# Altium schematic sheet LCD_TouchBackLight.SchDoc: =ProjectTitle
size B; Engineer: H. Collector; Organization: IMR Engineering; Address1: 3621 Gin Way; Address2: Snellville, GA 30039; Address3: USA; SheetNumber: 5; SheetTotal: 10
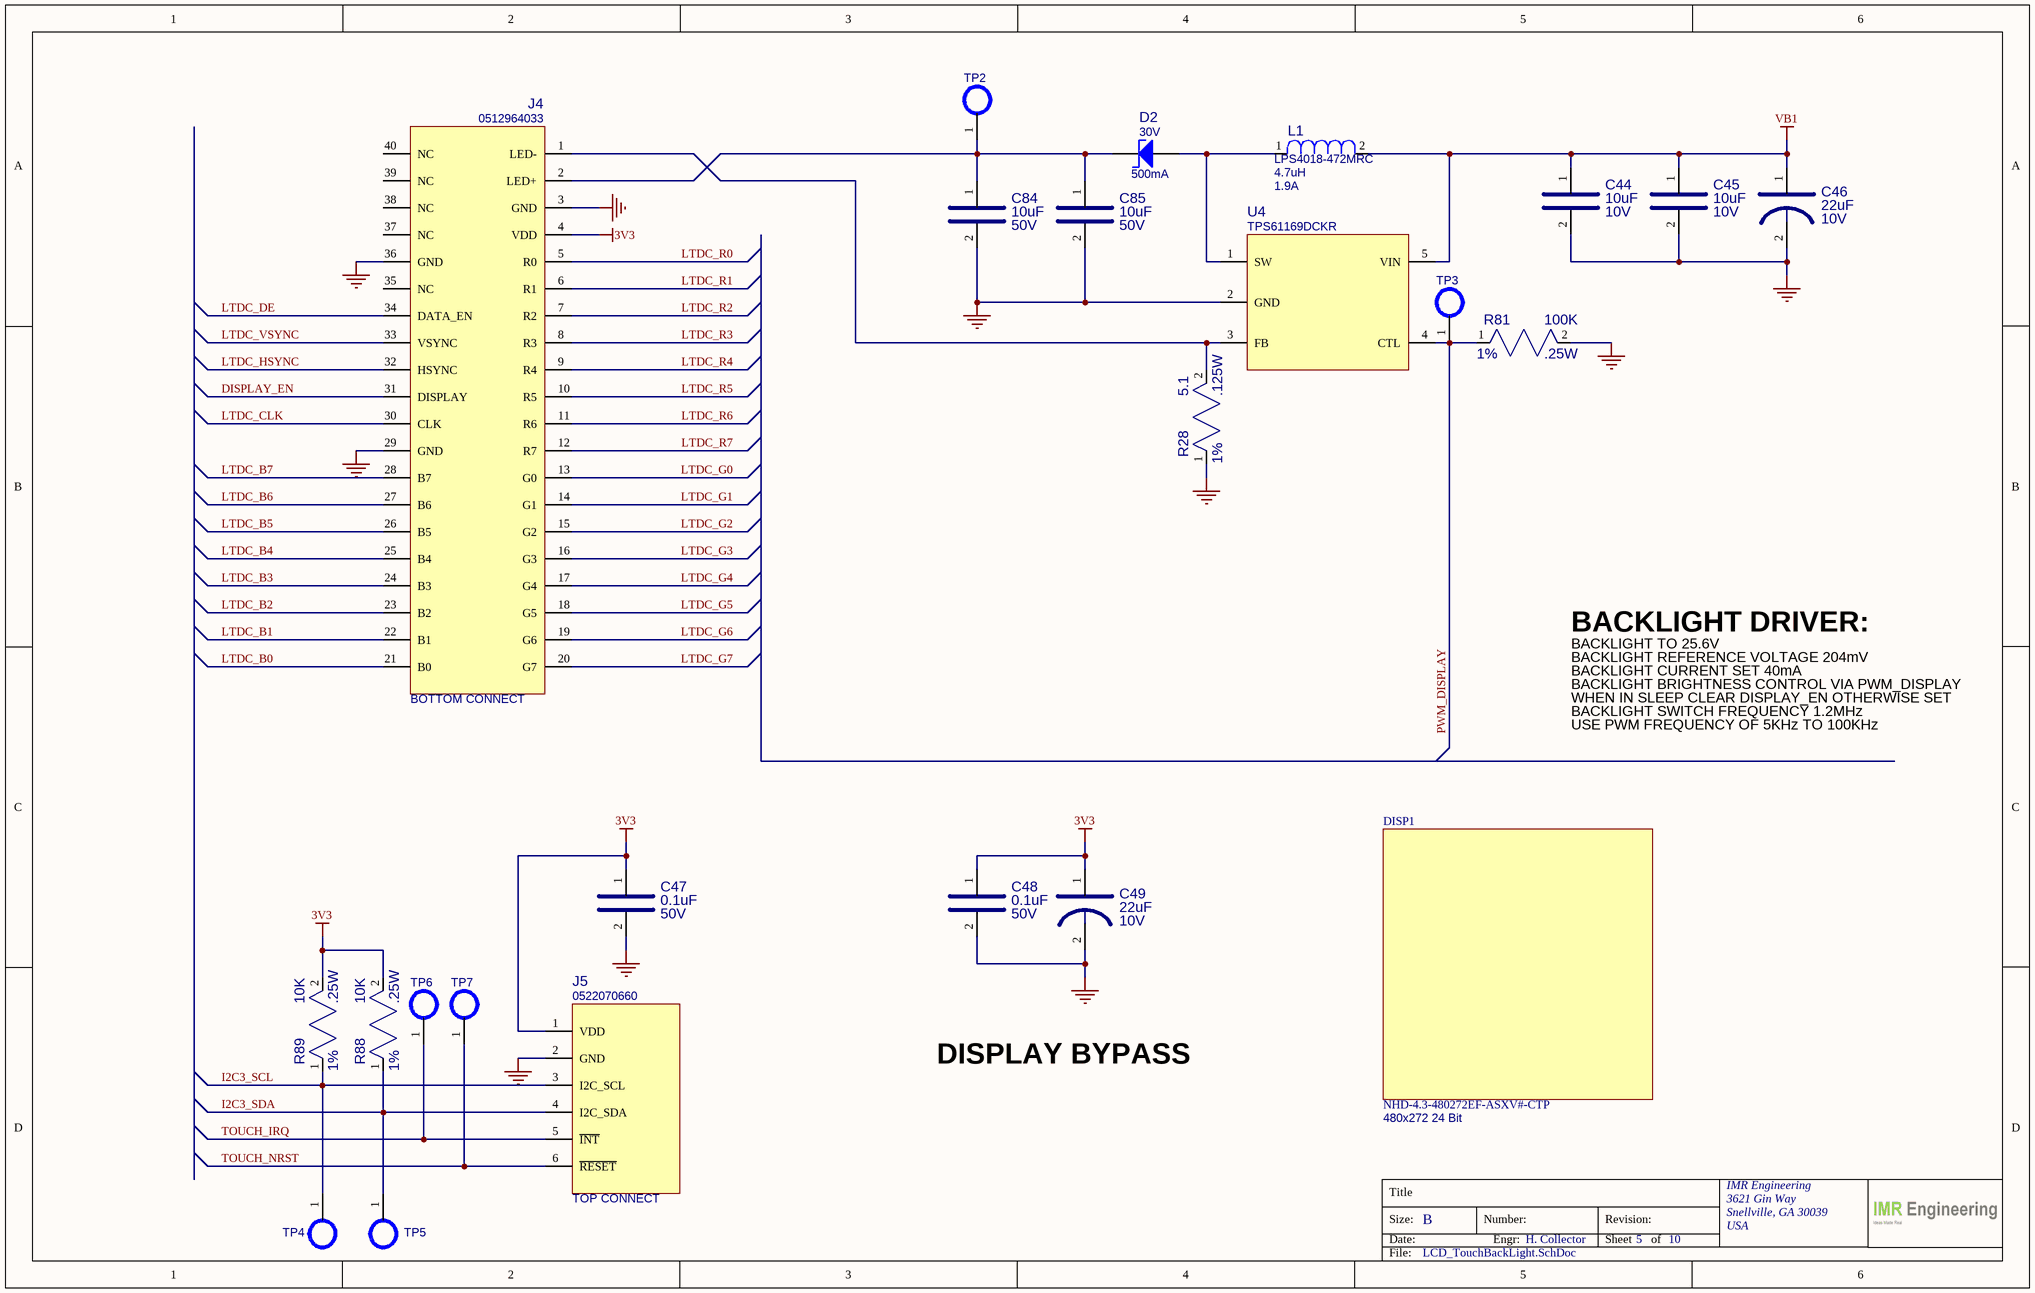
[diagram p0: LCD_TouchBackLight.SchDoc]

## Parts
C44  value 10uF  VOLTAGE: 10V  [CAP_0805]  (hidden comment: C2012X7R1A106K125AC)
C45  value 10uF  VOLTAGE: 10V  [CAP_0805]  (hidden comment: C2012X7R1A106K125AC)
C46  value 22uF  VOLTAGE: 10V  [CAP_1206_TANT]  (hidden comment: TAJA226M010RNJ)
C47  value 0.1uF  VOLTAGE: 50V  [CAP_0805]  (hidden comment: 08055C104KAT2A)
C48  value 0.1uF  VOLTAGE: 50V  [CAP_0805]  (hidden comment: 08055C104KAT2A)
C49  value 22uF  VOLTAGE: 10V  [CAP_1206_TANT]  (hidden comment: TAJA226M010RNJ)
C84  value 10uF  VOLTAGE: 50V  [CAP_1206]  (hidden comment: CL31A106KBHNNNE)
C85  value 10uF  VOLTAGE: 50V  [CAP_1206]  (hidden comment: CL31A106KBHNNNE)
D2  value 30V  Current: 500mA  [SOD123]  (hidden comment: PMEG3005EGWJ)
DISP1  NHD-4.3-480272EF-ASXV#-CTP  value 480x272 24 Bit  [NHD_NHD-4.3-480272EF-ASXV#-CTP]
J4  0512964033  value BOTTOM CONNECT  [CONN_MOLEX_0512964033]
J5  0522070660  value TOP CONNECT  [CONN_MOLEX_0522070660]
L1  value 4.7uH  Current: 1.9A  [LPS4018]  (hidden comment: LPS4018-472MRC)
R28  value 5.1  TOLERANCE: 1%  POWER: .125W  [PMG_RES_0805]  (hidden comment: RC0805FR-075R1L)
R81  value 100K  TOLERANCE: 1%  POWER: .25W  [PMG_RES_0805]  (hidden comment: RK73H2ATTD1003F)
R88  value 10K  TOLERANCE: 1%  POWER: .25W  [RES_0805]  (hidden comment: SG73S2ATTD1002F)
R89  value 10K  TOLERANCE: 1%  POWER: .25W  [RES_0805]  (hidden comment: SG73S2ATTD1002F)
TP2  TP_0635MM_HOLE  [TP_0635MM_HOLE]  (value not drawn)  (no BOM)
TP3  TP_0635MM_HOLE  [TP_0635MM_HOLE]  (value not drawn)  (no BOM)
TP4  TP_0635MM_HOLE  [TP_0635MM_HOLE]  (value not drawn)  (no BOM)
TP5  TP_0635MM_HOLE  [TP_0635MM_HOLE]  (value not drawn)  (no BOM)
TP6  TP_0635MM_HOLE  [TP_0635MM_HOLE]  (value not drawn)  (no BOM)
TP7  TP_0635MM_HOLE  [TP_0635MM_HOLE]  (value not drawn)  (no BOM)
U4  TPS61169DCKR  [SC70-5_SOT-353_5-TSSOP]

## Nets
3V3: C47.1 C48.1 C49.1 J4.4(VDD) J5.1(VDD) R88.2 R89.2
GND: C44.2 C45.2 C46.2 C47.2 C48.2 C49.2 C84.2 C85.2 J4.3(GND) J4.29(GND) J4.36(GND) J5.2(GND) R28.1 R81.2 U4.2(GND)
VB1: C44.1 C45.1 C46.1 L1.2 U4.5(VIN)
DISPLAY_EN: J4.31(DISPLAY)
I2C3_SCL: J5.3(I2C_SCL) R89.1 TP4.1
I2C3_SDA: J5.4(I2C_SDA) R88.1 TP5.1
LTDC_B0: J4.21(B0)
LTDC_B1: J4.22(B1)
LTDC_B2: J4.23(B2)
LTDC_B3: J4.24(B3)
LTDC_B4: J4.25(B4)
LTDC_B5: J4.26(B5)
LTDC_B6: J4.27(B6)
LTDC_B7: J4.28(B7)
LTDC_CLK: J4.30(CLK)
LTDC_DE: J4.34(DATA_EN)
LTDC_G0: J4.13(G0)
LTDC_G1: J4.14(G1)
LTDC_G2: J4.15(G2)
LTDC_G3: J4.16(G3)
LTDC_G4: J4.17(G4)
LTDC_G5: J4.18(G5)
LTDC_G6: J4.19(G6)
LTDC_G7: J4.20(G7)
LTDC_HSYNC: J4.32(HSYNC)
LTDC_R0: J4.5(R0)
LTDC_R1: J4.6(R1)
LTDC_R2: J4.7(R2)
LTDC_R3: J4.8(R3)
LTDC_R4: J4.9(R4)
LTDC_R5: J4.10(R5)
LTDC_R6: J4.11(R6)
LTDC_R7: J4.12(R7)
LTDC_VSYNC: J4.33(VSYNC)
PWM_DISPLAY: R81.1 TP3.1 U4.4(CTL)
TOUCH_IRQ: J5.5(~{INT}) TP6.1
TOUCH_NRST: J5.6(~{RESET}) TP7.1
NetC84_1: C84.1 C85.1 D2.2(K) J4.2(LED+) TP2.1
NetD2_1: D2.1(A) L1.1 U4.1(SW)
NetJ4_1: J4.1(LED-) R28.2 U4.3(FB)

Not connected (* = marked no-connect by the designer): J4 35(NC) 37(NC) 38(NC) 39(NC) 40(NC)

## Notes on the sheet
- BACKLIGHT DRIVER:
- BACKLIGHT TO 25.6V
- BACKLIGHT CURRENT SET 40mA
- BACKLIGHT BRIGHTNESS CONTROL VIA PWM_DISPLAY
- WHEN IN SLEEP CLEAR DISPLAY_EN OTHERWISE SET
- BACKLIGHT REFERENCE VOLTAGE 204mV
- BACKLIGHT SWITCH FREQUENCY 1.2MHz
- USE PWM FREQUENCY OF 5KHz TO 100KHz
- DISPLAY BYPASS
- Title
- Size:
- Date:
- B
- Number:
- Engr:
- Revision:
- Sheet
- of
- File:

## Library data of the parts
C44 C45 = CAP_10UF_10V_0805: CAP CER 10UF 10V X7R 0805; MFG: TDK Corporation; TOLERANCE: 10%; MFG_PN: C2012X7R1A106K125AC; Supplier 1: Digi-Key; Supplier Part Number 1: 445-6857-1-ND; Case/Package: 0805; ClassName: Display_BacklightDriver
C46 C49 = CAP_22UF_10V_TANT: CAP TANT 22UF 20% 10V 1206; MFG: AVX Corporation; TOLERANCE: 10%; MFG_PN: TAJA226M010RNJ; Supplier 1: Digi-Key; Supplier Part Number 1: 478-5798-1-ND
  C46: ClassName: Display_BacklightDriver
C47 C48 = CAP_0.1UF_50V_0805: CAP CER 0.1UF 50V X7R 0805; MFG: AVX; TOLERANCE: 10%; MFG_PN: 08055C104KAT2A; Supplier 1: Digi-Key; Supplier Part Number 1: 478-1395-1-ND; Case/Package: 0805
  C48: ClassName: Display_BacklightDriver
C84 C85 = CAP_10UF_50V_1206: CAP CER 10UF 50V X5R 1206; MFG: Samsung Electro-Mechanics; TOLERANCE: 10%; MFG_PN: CL31A106KBHNNNE; Supplier 1: Digi-Key; Supplier Part Number 1: 1276-2876-1-ND; Case/Package: 0805; ClassName: Display_BacklightDriver
D2 = DIODE_SCHOTTKY_PMEG3005EGWJ: DIODE SCHOTTKY 30V 500MA SOD123; MFG: Nexperia USA Inc.; ComponentLink1Description: Manufacturer Link; ComponentLink1URL: http://www.fairchildsemi.com/; ComponentLink2Description: Datasheet; ComponentLink2URL: http://www.fairchildsemi.com/ds/1N%2F1N4148.pdf; Supplier 1: Digi-Key; Supplier Part Number 1: MBRS2040LT3GOSCT-ND; MFG_PN: PMEG3005EGWJ; Case/Package: SOD-123; ClassName: Display_BacklightDriver
DISP1 = MODULE_NHD-4.3-480272EF-ASXV#-CTP: LCD TFT 480X272 HIGH BRIGHT; MFG: Newhaven Display Intl; MFG_PN: NHD-4.3-480272EF-ASXV#-CTP; Supplier Part Number 1: NHD-4.3-480272EF-ASXV#-CTP-ND; Supplier 1: DigiKey; ClassName: Display_Connector
J4 = CONN_MOLEX_0512964033: CONN FFC BOTTOM 40POS 0.50MM R/A; MFG: Molex; Case/Package: 0512964033; Supplier 1: Digi-Key; Supplier Part Number 1: WM11237CT-ND; MFG_PN: 0512964033; ClassName: Display_Connector
J5 = CONN_MOLEX_0522070660: CONN FPC TOP 6POS 1.00MM R/A; MFG: Molex; Case/Package: 0522070660; Supplier 1: Digi-Key; Supplier Part Number 1: WM10939CT-ND; MFG_PN: 0522070660; ClassName: Display_Connector
L1 = INDUCTOR_LPS4018-472MRC: SHIELDED POWER INDUCTORS, 4.7UH; MFG: COILCRAFT; TOLERANCE: 20%; Supplier 1: Digi-Key; Supplier Part Number 1: 2457-LPS4018-472MRC-ND; MFG_PN: LPS4018-472MRC; ClassName: Display_BacklightDriver
R28 = RES_5.1_0805_1/8W_1%: RES 5.1 OHM 1% 1/8W 0805; MFG: Yageo; Case/Package: 0805; MFG_PN: RC0805FR-075R1L; Supplier 1: Digi-Key; Supplier Part Number 1: YAG3373CT-ND; ClassName: Display_BacklightDriver
R81 = RES_100K_0805_1/4W_1%: RES SMD 100K OHM 1% 1/4W 0805; MFG: KOA Speer Electronics, Inc.; Case/Package: 0805; MFG_PN: RK73H2ATTD1003F; Supplier 1: Digi-Key; Supplier Part Number 1: 2019-RK73H2ATTD1003FCT-ND; ClassName: Display_BacklightDriver
R88 R89 = RES_10K_0805_1/4W_1%: RES SMD 10K OHM 1% 1/4W 0805; MFG: KOA Speer Electronics, Inc.; Case/Package: 0805; MFG_PN: SG73S2ATTD1002F; Supplier 1: Digi-Key; Supplier Part Number 1: 2019-SG73S2ATTD1002FCT-ND; ClassName: Display_Connector
TP2-TP7 = TP_0635MM_HOLE: 3MM IN D. MT HOLE
U4 = IC_TPS61169DCKR: IC LED DRVR RGLTR DIM 1.8A SC70; MFG: Texas Instruments; Supplier 1: Digi-Key; Supplier Part Number 1: 296-40821-1-ND; VALUE: 1.8A; Case/Package: SC70; MFG_PN: TPS61169DCKR; ClassName: Display_BacklightDriver